# EAGLE schematic schematic_pic_pcb (EAGLE 9.3.0)
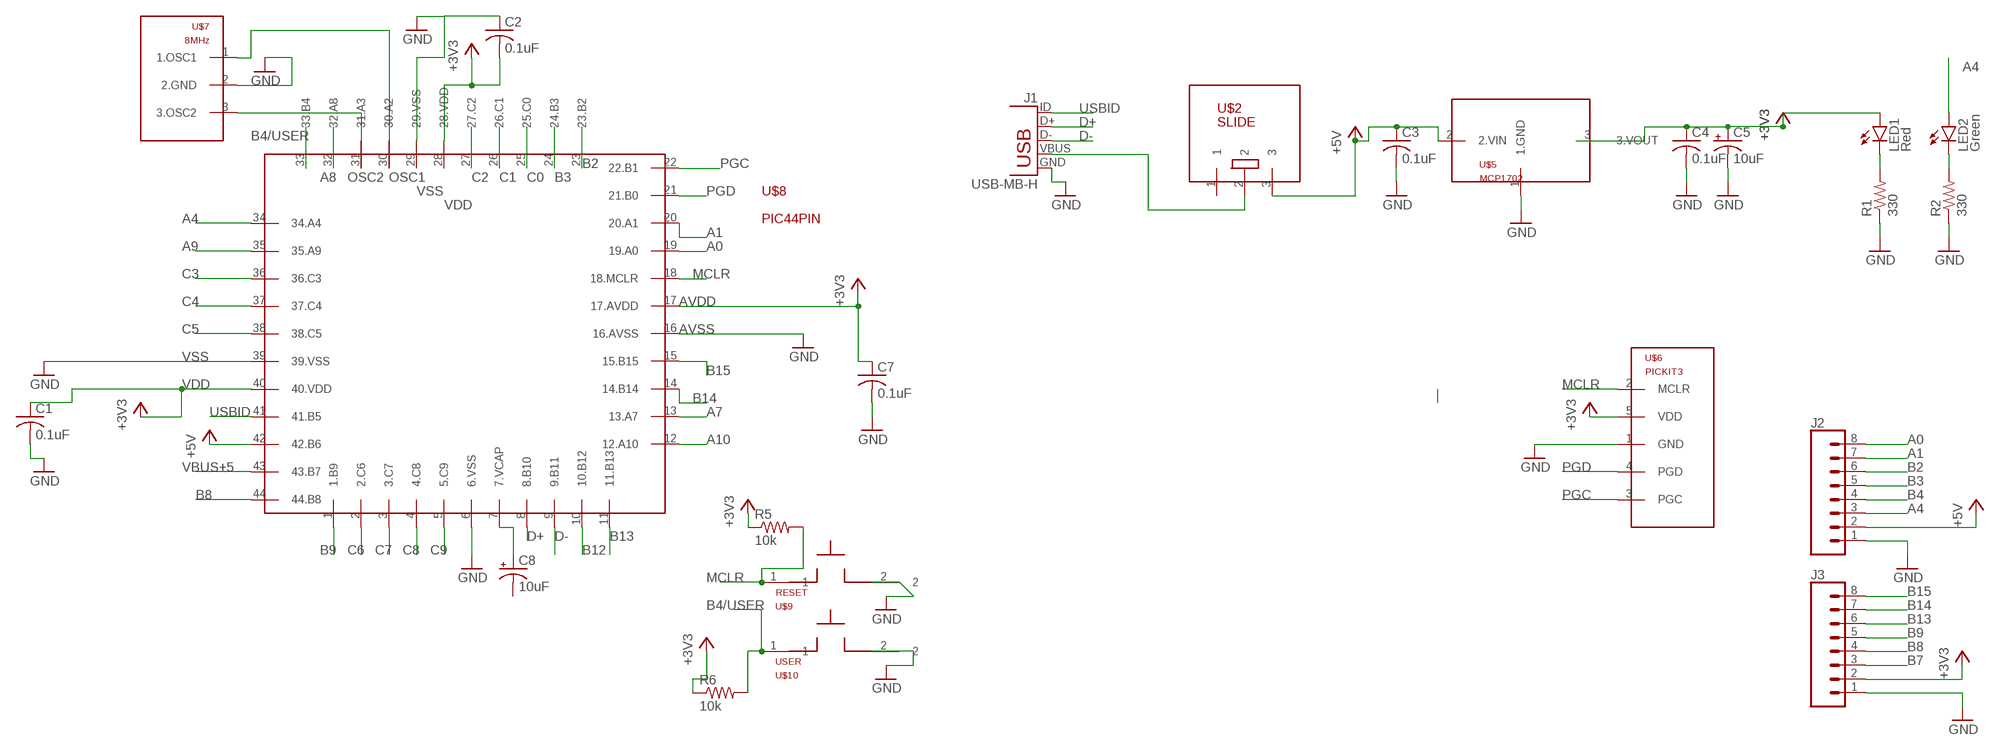
[diagram p0: schematic, sheet 1]

## Parts
C1  0.1uF  C-US025-025X050  [C025-025X050]
C2  0.1uF  C-US025-025X050  [C025-025X050]
C3  0.1uF  C-US025-025X050  [C025-025X050]
C4  0.1uF  C-US025-025X050  [C025-025X050]
C5  10uF  CPOL-USB45181B  [B45181B]
C7  0.1uF  C-US025-025X050  [C025-025X050]
C8  10uF  CPOL-USB45181B  [B45181B]
J1  USB-MB-H  [USB-MB-H]
J2  CONN_08  [1X08]
J3  CONN_08  [1X08]
LED1  Red  LED3MM  [LED3MM]
LED2  Green  LED3MM  [LED3MM]
R1  330  R-US_0207/10  [0207/10]
R2  330  R-US_0207/10  [0207/10]
R5  10k  R-US_0207/10  [0207/10]
R6  10k  R-US_0207/10  [0207/10]
U$2  SLIDE  [SLIDE]
U$5  MCP1702  [TO92]
U$6  PICKIT3  [1X05]
U$7  8MHz  OSC  [OSC]
U$8  PIC44PIN  [TQFP44]
U$9  RESET  PB  [PB]
U$10  USER  PB  [PB]

## Nets
+3V3: C4.1 C5.+ J3.2 LED1.A R5.1 R6.1 U$5.3(3.VOUT) U$6.5(VDD)
+5V: C3.1 J2.2 U$2.3 U$5.2(2.VIN)
A0: J2.8 U$8.19(19.A0)
A1: J2.7 U$8.20(20.A1)
A4: J2.3 LED2.A U$8.34(34.A4)
A7: U$8.13(13.A7)
A8: U$8.32(32.A8)
A9: U$8.35(35.A9)
A10: U$8.12(12.A10)
AVDD: C7.1 U$8.17(17.AVDD) ; supply symbol labelled +3V3
AVSS: U$8.16(16.AVSS) ; supply symbol labelled GND
B2: J2.6 U$8.23(23.B2)
B3: J2.5 U$8.24(24.B3)
B4: J2.4
B4/USER: R6.2 U$8.33(33.B4) U$10.1
B7: J3.3
B8: J3.4 U$8.44(44.B8)
B9: J3.5 U$8.1(1.B9)
B12: U$8.10(10.B12)
B13: J3.6 U$8.11(11.B13)
B14: J3.7 U$8.14(14.B14)
B15: J3.8 U$8.15(15.B15)
C0: U$8.25(25.C0)
C1: U$8.26(26.C1)
C2: U$8.27(27.C2)
C3: U$8.36(36.C3)
C4: U$8.37(37.C4)
C5: U$8.38(38.C5)
C6: U$8.2(2.C6)
C7: U$8.3(3.C7)
C8: U$8.4(4.C8)
C9: U$8.5(5.C9)
D+: J1.D+ U$8.8(8.B10)
D-: J1.D- U$8.9(9.B11)
GND: C1.2 C3.2 C4.2 C5.- C7.2 J1.GND J2.1 J3.1 R1.1 R2.1 U$5.1(1.GND) U$6.1(GND) U$7.2(2.GND) U$8.6(6.VSS) U$9.2 U$10.2
MCLR: R5.2 U$6.2(MCLR) U$8.18(18.MCLR) U$9.1
N$1: J1.VBUS U$2.2
N$2: LED2.K(C) R2.2
N$3: LED1.K(C) R1.2
N$7: C8.+ U$8.7(7.VCAP)
N$17: U$8.43(43.B7)
OSC1: U$7.1(1.OSC1) U$8.30(30.A2)
OSC2: U$7.3(3.OSC2) U$8.31(31.A3)
PGC: U$6.3(PGC) U$8.22(22.B1)
PGD: U$6.4(PGD) U$8.21(21.B0)
USBID: J1.ID U$8.41(41.B5)
VBUS+5: U$8.42(42.B6) ; supply symbol labelled +5V
VDD: C1.1 C2.2 U$8.40(40.VDD) ; supply symbol labelled +3V3
VSS: C2.1 U$8.39(39.VSS) ; supply symbol labelled GND
Unconnected: C8.- U$2.1 U$8.28(28.VDD) U$8.29(29.VSS)

## Library data of the parts
C1-C4 C7 = rcl:C-US: CAPACITOR, American symbol; SPICEPREFIX: C
C5 C8 = rcl:CPOL-US: POLARIZED CAPACITOR, American symbol; SPICEPREFIX: C
J1 = untitled:USB: USB Connectors USB-B-PTH is fully proven SKU : PRT-00139/CONN-08278 USB-miniB is fully proven SKU : PRT-00587 USB-A-PCB is untested. USB-A-H is throughly reviewed, but untested. Spark Fun Electronics SKU : PRT-00437 USB-B-SMT is throughly reviewed, but untested. Needs silkscreen touching up. USB-A-S has not been used/tested USB-MB-H has not been used/tested USB-MICROB has been used. CONN-09505
J2 J3 = untitled:CONN_08: Multi connection point. Often used as Generic Header-pin footprint for 0.1 inch spaced/style header connections On any of the 0.1 inch spaced packages, you can populate with these: Break Away Headers - Straight <https://www.sparkfun.com/products/116> (PRT-00116) Break Away Male Headers - Right Angle <https://www.sparkfun.com/products/553> (PRT-00553) Female Headers <https://www.sparkfun.com/products/115> (PRT-00115) Break Away Headers - Machine Pin <https://www.sparkfun.com/products/117> (PRT-00117) Break Away Female Headers - Swiss Machine Pin <https://www.sparkfun.com/products/743> (PRT-00743) Arduino Stackable Header - 8 Pin <https://www.sparkfun.com/products/9279> (PRT-09279) For SCREWTERMINALS and SPRING TERMINALS visit here: Screw Terimnals on SparkFun.com <https://www.sparkfun.com/search/results?term=Screw+Terminals> (5mm/3.5mm/2.54mm spacing) This device is also useful as a general connection point to wire up your design to another part of your project. Our various solder wires solder well into these plated through hole pads. Hook-Up Wire - Assortment (Stranded, 22 AWG) <https://www.sparkfun.com/products/11375> (PRT-11375) Hook-Up Wire - Assortment (Solid Core, 22 AWG) <https://www.sparkfun.com/products/11367> (PRT-11367) View the entire wire category on our website here <https://www.sparkfun.com/categories/141> Special notes: Molex polarized connector foot print use with SKU : PRT-08231 with associated crimp pins and housings. 1MM SMD Version SKU: PRT-10208 NOTES ON THE VARIANTS LOCK and LOCK_LONGPADS... This footprint was designed to help hold the alignment of a through-hole component (i.e. 6-pin header) while soldering it into place. You may notice that each hole has been shifted either up or down by 0.005 of an inch from it's more standard position (which is a perfectly straight line). This slight alteration caused the pins (the squares in the middle) to touch the edges of the holes. Because they are alternating, it causes a "brace" to hold the component in place. 0.005 has proven to be the perfect amount of "off-center" position when using our standard breakaway headers. Although looks a little odd when you look at the bare footprint, once you have a header in there, the alteration is very hard to notice. Also,if you push a header all the way into place, it is covered up entirely on the bottom side.
LED1 LED2 = led:LED: LED OSRAM: - CHIPLED LG R971, LG N971, LY N971, LG Q971, LY Q971, LO R971, LY R971 LH N974, LH R974 LS Q976, LO Q976, LY Q976 LO Q996 - Hyper CHIPLED LW Q18S LB Q993, LB Q99A, LB R99A - SideLED LS A670, LO A670, LY A670, LG A670, LP A670 LB A673, LV A673, LT A673, LW A673 LH A674 LY A675 LS A676, LA A676, LO A676, LY A676, LW A676 LS A679, LY A679, LG A679 - Hyper Micro SIDELED® LS Y876, LA Y876, LO Y876, LY Y876 LT Y87S - SmartLED LW L88C, LW L88S LB L89C, LB L89S, LG L890 LS L89K, LO L89K, LY L89K LS L896, LA L896, LO L896, LY L896 - TOPLED LS T670, LO T670, LY T670, LG T670, LP T670 LSG T670, LSP T670, LSY T670, LOP T670, LYG T670 LG T671, LOG T671, LSG T671 LB T673, LV T673, LT T673, LW T673 LH T674 LS T676, LA T676, LO T676, LY T676, LB T676, LH T676, LSB T676, LW T676 LB T67C, LV T67C, LT T67C, LS T67K, LO T67K, LY T67K, LW E67C LS E67B, LA E67B, LO E67B, LY E67B, LB E67C, LV E67C, LT E67C LW T67C LS T679, LY T679, LG T679 LS T770, LO T770, LY T770, LG T770, LP T770 LB T773, LV T773, LT T773, LW T773 LH T774 LS E675, LA E675, LY E675, LS T675 LS T776, LA T776, LO T776, LY T776, LB T776 LHGB T686 LT T68C, LB T68C - Hyper Mini TOPLED® LB M676 - Mini TOPLED Santana® LG M470 LS M47K, LO M47K, LY M47K Source: http://www.osram.convergy.de LUXEON: - LUMILED® LXK2-PW12-R00, LXK2-PW12-S00, LXK2-PW14-U00, LXK2-PW14-V00 LXK2-PM12-R00, LXK2-PM12-S00, LXK2-PM14-U00 LXK2-PE12-Q00, LXK2-PE12-R00, LXK2-PE12-S00, LXK2-PE14-T00, LXK2-PE14-U00 LXK2-PB12-K00, LXK2-PB12-L00, LXK2-PB12-M00, LXK2-PB14-N00, LXK2-PB14-P00, LXK2-PB14-Q00 LXK2-PR12-L00, LXK2-PR12-M00, LXK2-PR14-Q00, LXK2-PR14-R00 LXK2-PD12-Q00, LXK2-PD12-R00, LXK2-PD12-S00 LXK2-PH12-R00, LXK2-PH12-S00 LXK2-PL12-P00, LXK2-PL12-Q00, LXK2-PL12-R00 Source: www.luxeon.com KINGBRIGHT: KA-3528ASYC Source: www.kingbright.com
R1 R2 R5 R6 = rcl:R-US_: RESISTOR, American symbol; SPICEPREFIX: R
U$2 = untitled:SLIDE
U$5 = untitled:MCP1702
U$6 = untitled:PICKIT3
U$7 = untitled:OSC
U$8 = untitled:PIC44PIN
U$9 U$10 = untitled:PB